# EAGLE schematic ESS_Rev0 (EAGLE 5.11)
DO_NOT_POPULATE: DNP; REV: 0; WARP9_PARTNO: WTJ206
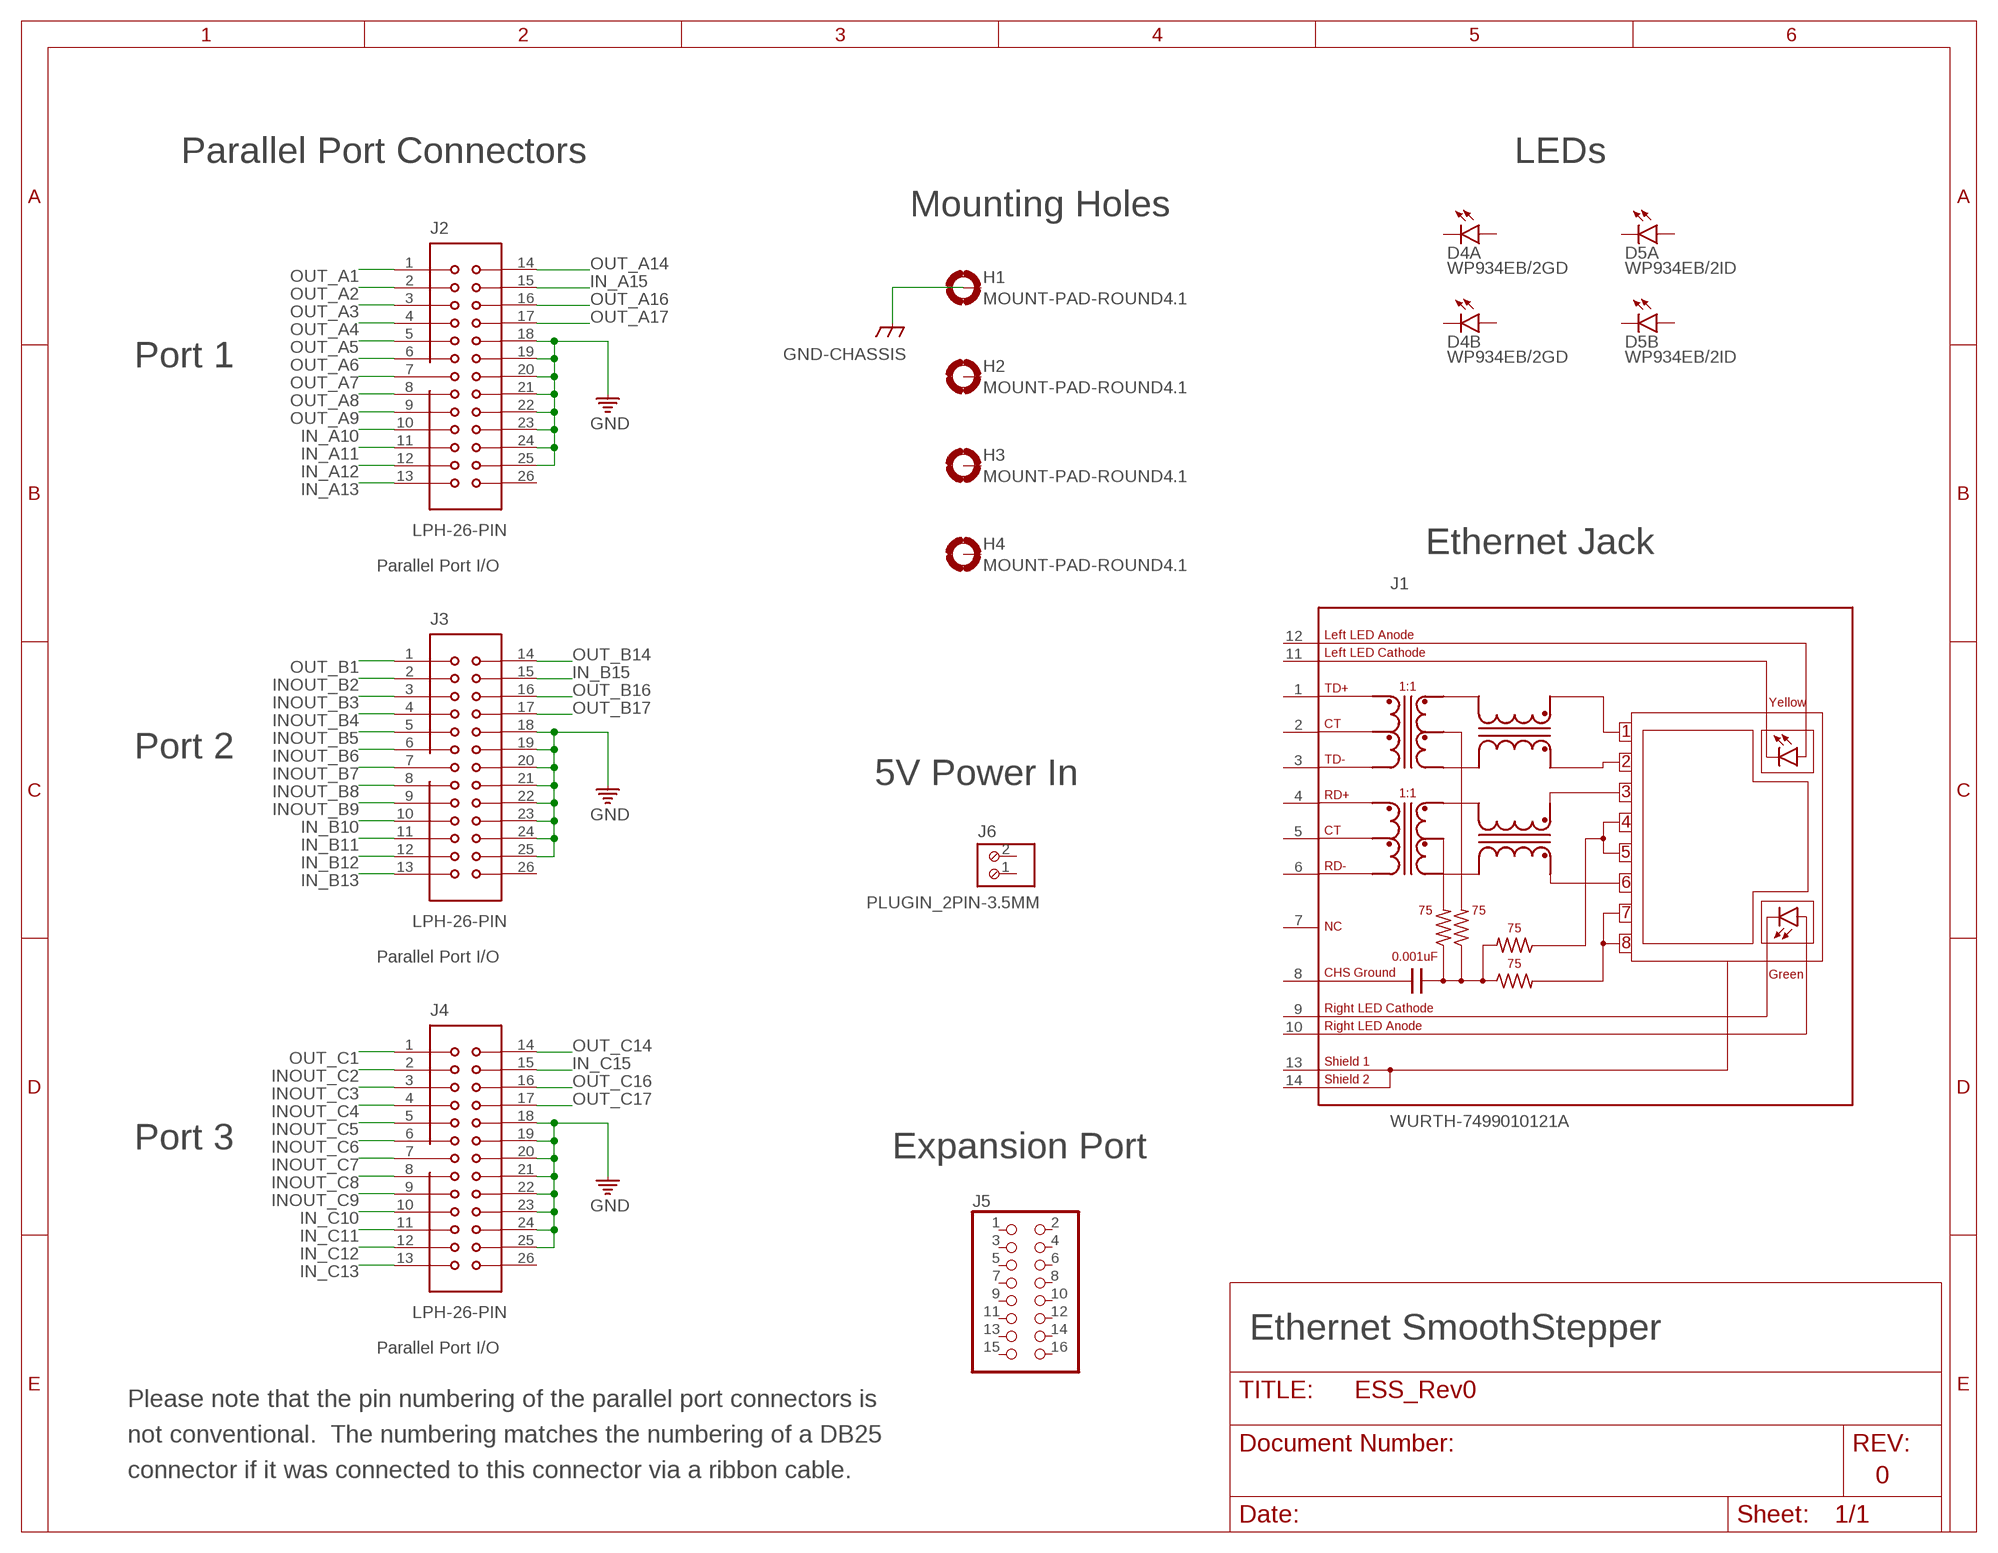
[diagram p0: schematic, sheet 1]

## Parts
D4  WP934EB/2GD  [KINGBRIGHT_WP934EB/2GD]
D5  WP934EB/2ID  WP934EB/2GD  [KINGBRIGHT_WP934EB/2GD]
H1  MOUNT-PAD-ROUND4.1  [4,1-PAD]
H2  MOUNT-PAD-ROUND4.1  [4,1-PAD]
H3  MOUNT-PAD-ROUND4.1  [4,1-PAD]
H4  MOUNT-PAD-ROUND4.1  [4,1-PAD]
J1  WURTH-7499010121A  [WURTH-7499010121A]
J2  LPH-26-PIN  [LOWPROFILEHEADER-26PIN]
J3  LPH-26-PIN  [LOWPROFILEHEADER-26PIN]
J4  LPH-26-PIN  [LOWPROFILEHEADER-26PIN]
J5  PINHD-2X8  [2X08]
J6  PLUGIN_2PIN-3.5MM  [PLUGIN_2PIN-3.5MM]

## Nets
GND: J2.18 J2.19 J2.20 J2.21 J2.22 J2.23 J2.24 J2.25 J3.18 J3.19 J3.20 J3.21 J3.22 J3.23 J3.24 J3.25 J4.18 J4.19 J4.20 J4.21 J4.22 J4.23 J4.24 J4.25
GND-CHASSIS: H1.B4,1(MOUNT)
IN_A10: J2.10
IN_A11: J2.11
IN_A12: J2.12
IN_A13: J2.13
IN_A15: J2.15
IN_B10: J3.10
IN_B11: J3.11
IN_B12: J3.12
IN_B13: J3.13
IN_B15: J3.15
IN_C10: J4.10
IN_C11: J4.11
IN_C12: J4.12
IN_C13: J4.13
IN_C15: J4.15
INOUT_B2: J3.2
INOUT_B3: J3.3
INOUT_B4: J3.4
INOUT_B5: J3.5
INOUT_B6: J3.6
INOUT_B7: J3.7
INOUT_B8: J3.8
INOUT_B9: J3.9
INOUT_C2: J4.2
INOUT_C3: J4.3
INOUT_C4: J4.4
INOUT_C5: J4.5
INOUT_C6: J4.6
INOUT_C7: J4.7
INOUT_C8: J4.8
INOUT_C9: J4.9
OUT_A1: J2.1
OUT_A2: J2.2
OUT_A3: J2.3
OUT_A4: J2.4
OUT_A5: J2.5
OUT_A6: J2.6
OUT_A7: J2.7
OUT_A8: J2.8
OUT_A9: J2.9
OUT_A14: J2.14
OUT_A16: J2.16
OUT_A17: J2.17
OUT_B1: J3.1
OUT_B14: J3.14
OUT_B16: J3.16
OUT_B17: J3.17
OUT_C1: J4.1
OUT_C14: J4.14
OUT_C16: J4.16
OUT_C17: J4.17
Unconnected: D4.A1(A:A) D4.A2(B:A) D4.C1(A:C) D4.C2(B:C) D5.A1(A:A) D5.A2(B:A) D5.C1(A:C) D5.C2(B:C) H2.B4,1(MOUNT) H3.B4,1(MOUNT) H4.B4,1(MOUNT) J1.1(TD+) J1.2(TCT) J1.3(TD-) J1.4(RD+) J1.5(RCT) J1.6(RD-) J1.7(NC) J1.8(GROUND) J1.9(RIGHT_CATHODE) J1.10(RIGHT_ANODE) J1.11(LEFT_CATHODE) J1.12(LEFT_ANODE) J1.13(SHIELD1) J1.14(SHIELD2) J2.26 J3.26 J4.26 J5.1 J5.2 J5.3 J5.4 J5.5 J5.6 J5.7 J5.8 J5.9 J5.10 J5.11 J5.12 J5.13 J5.14 J5.15 J5.16 J6.1 J6.2

## Notes on the sheet
- Parallel Port Connectors | LEDs
- Mounting Holes
- Port 1
- Ethernet Jack
- Parallel Port I/O
- Port 2
- 5V Power In
- Parallel Port I/O
- Port 3
- Expansion Port
- Ethernet SmoothStepper
- Parallel Port I/O
- Please note that the pin numbering of the parallel port connectors is
- not conventional.  The numbering matches the numbering of a DB25
- connector if it was connected to this connector via a ribbon cable.

## Library data of the parts
D4 D5 = my_led:WP934EB/2GD
H1-H4 = my_holes:MOUNT-PAD-ROUND: MOUNTING PAD, round
J1 = Ethernet:WURTH-7499010121A
J2-J4 = 26-pin-Header:LPH-26-PIN
J5 = my_pinhead:PINHD-2X8: PIN HEADER
J6 = TerminalBlock-PluginRightAngle:PLUGIN_2PIN-3.5MM